# EasyEDA schematic New Project.json
TITLE: Sheet_1; REV: 1.0; Date: 2023-08-31; Sheet: 1/1; Drawn By: KovaKoodaaja666; Company: Your Company
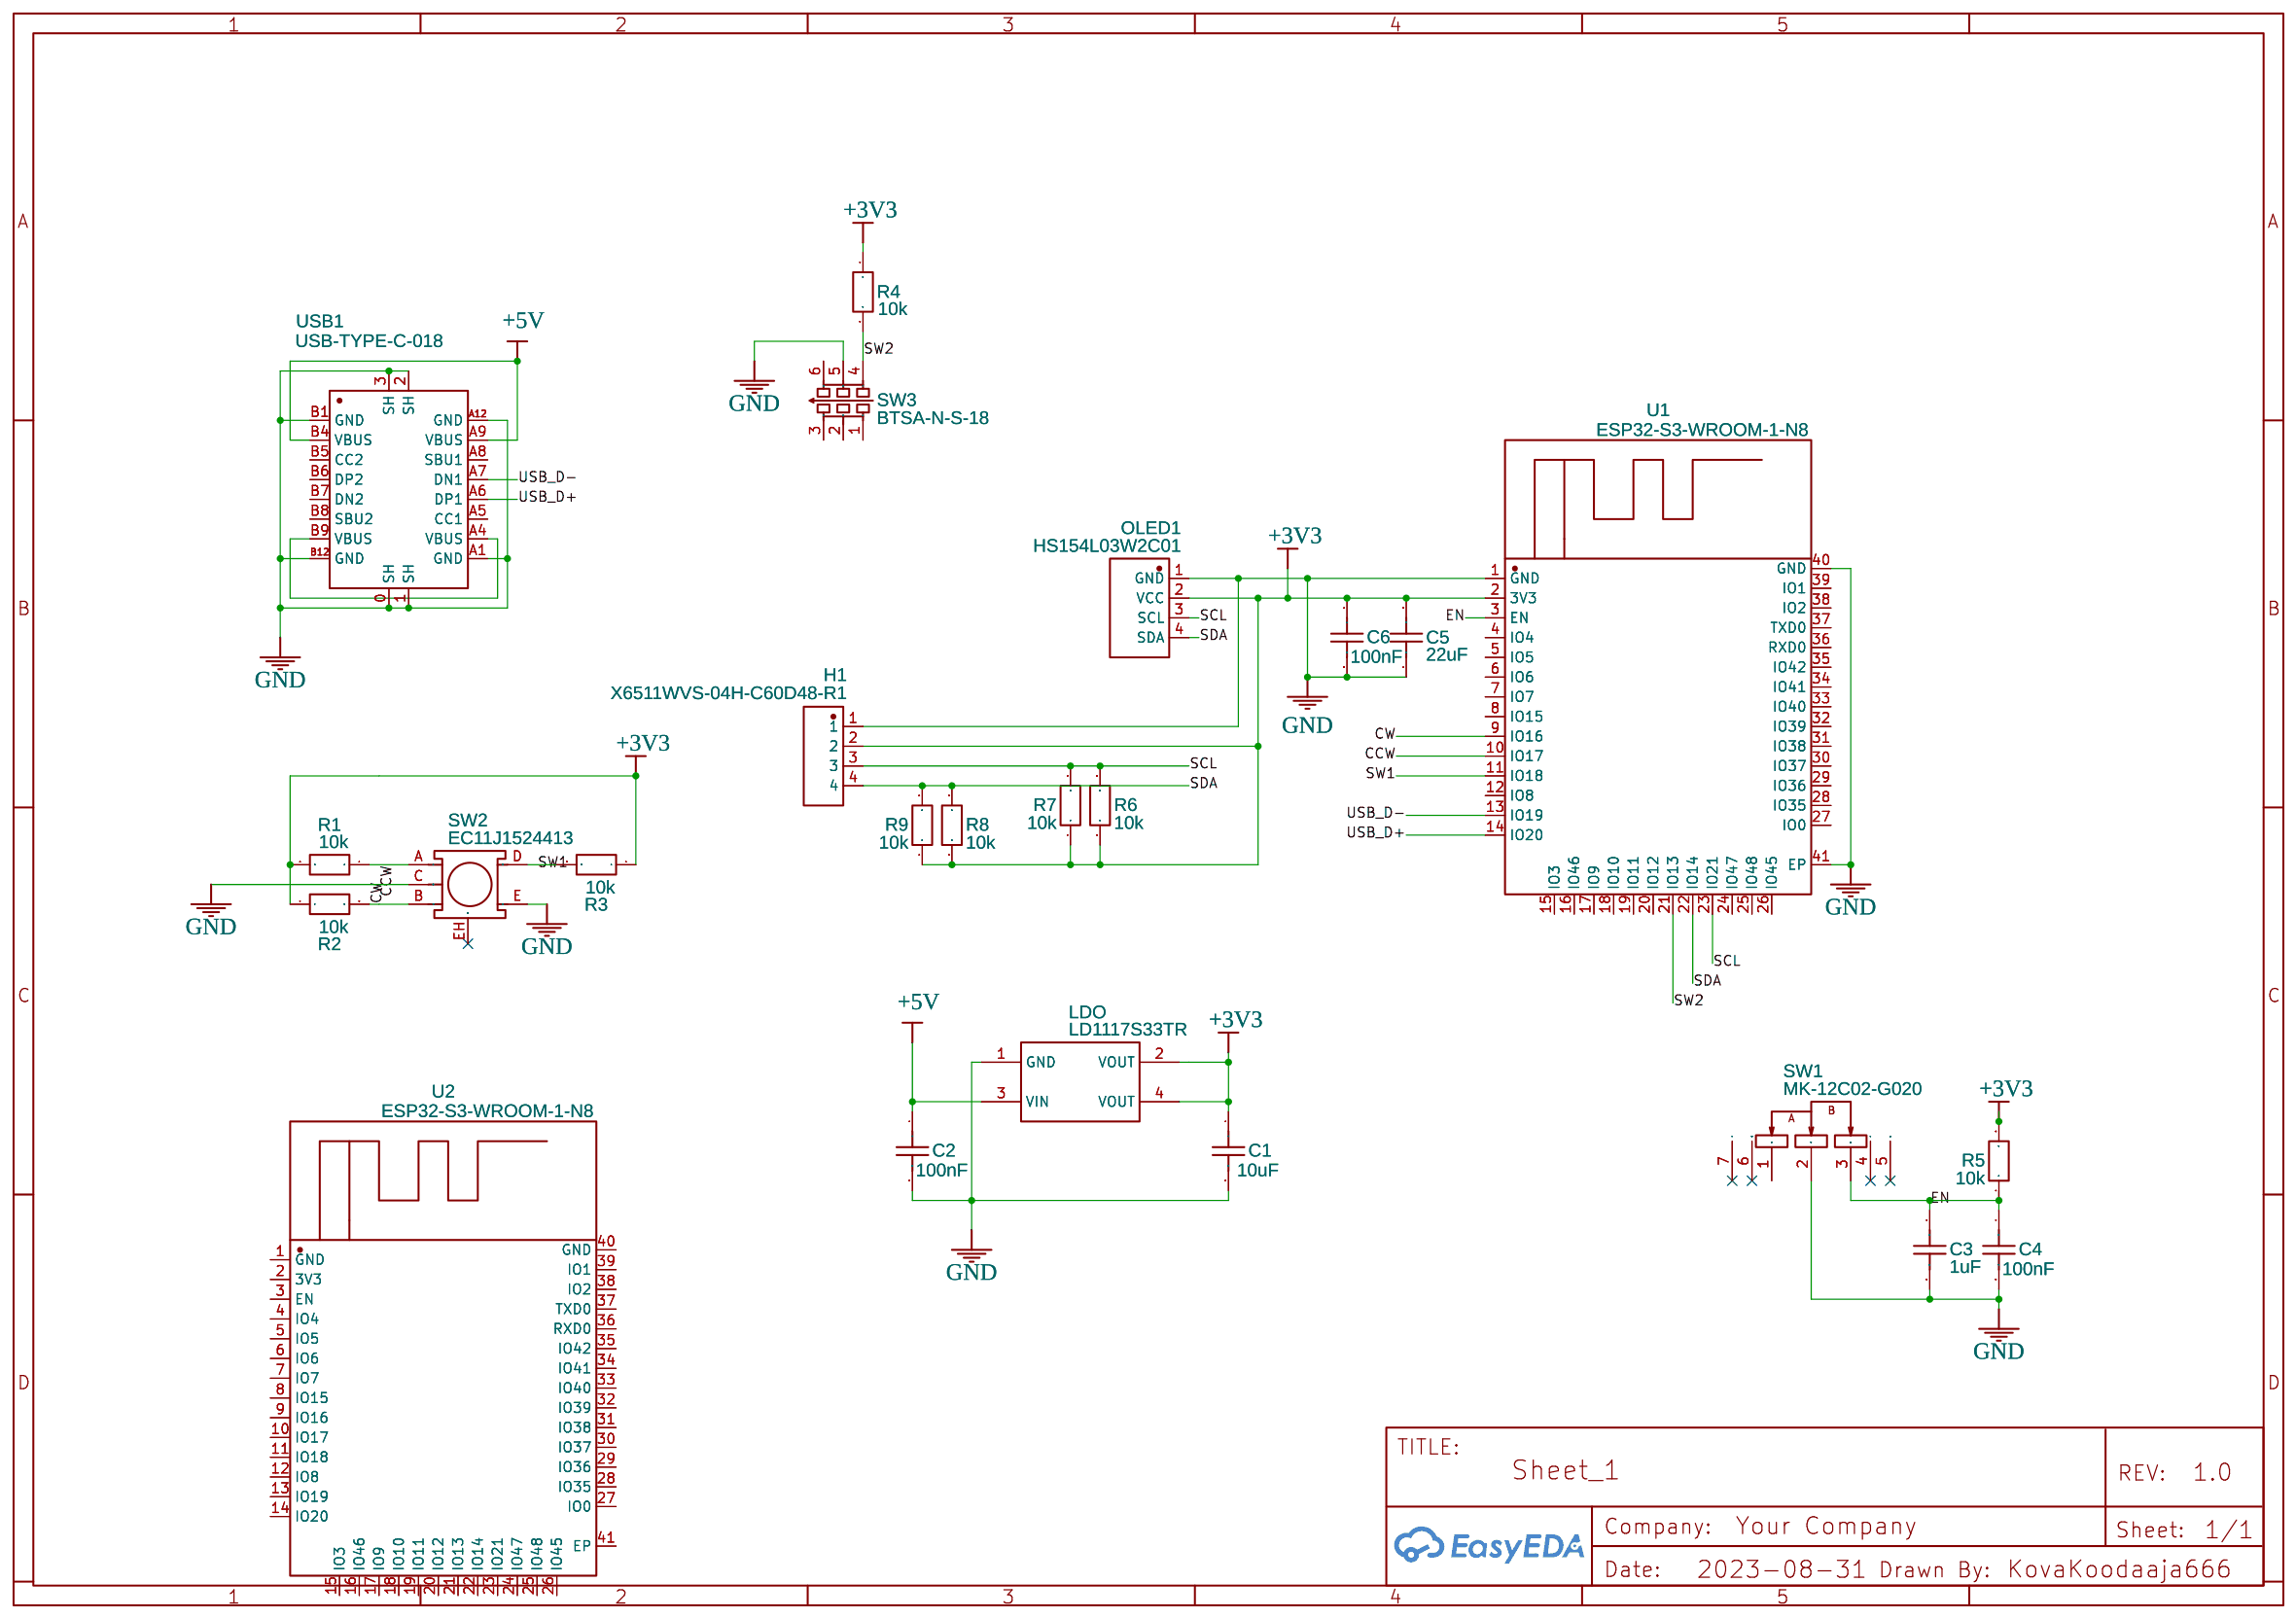
[diagram p0: schematic sheet]

## Parts
C1  10uF  [C0805]
C2  100nF  [C0805]
C3  1uF  [C0805]
C4  100nF  [C0805]
C5  22uF  [C0805]
C6  100nF  [C0805]
H1  X6511WVS-04H-C60D48-R1  [HDR-SMD_4P-P2.54-V-M-S4.8]
LDO  LD1117S33TR  [SOT-223_L6.5-W3.5-P2.30-LS7.0-BR]
OLED1  HS154L03W2C01  [OLED-TH_-4P-L42.4-W38.0-P2.54]
R1  10k  [R0603]
R2  10k  [R0603]
R3  10k  [R0603]
R4  10k  [R0603]
R5  10k  [R0603]
R6  10k  [R0603]
R7  10k  [R0603]
R8  10k  [R0603]
R9  10k  [R0603]
SW1  MK-12C02-G020  [SW-SMD_MK-12C02-G020]
SW2  EC11J1524413  [SW-SMD_EC11J1524413]
SW3  BTSA-N-S-18  [SW-SMD_BTSA-X-S-18]
U1  ESP32-S3-WROOM-1-N8  [ESP32 S3 WROOM1 N8]
U2  ESP32-S3-WROOM-1-N8  [WIFIM-SMD_ESP32-S3-WROOM-1-N8]
USB1  USB-TYPE-C-018  [USB-C_SMD-TYPE-C-31-M-12]

## Library data of the parts
C1 = TCC0805X5R106K100FT: Supplier: LCSC; Supplier Part: C380331; Manufacturer: CCTC(三环); Contributor: LCSC; JLCPCB Part Class: Extended Part
C2 C4 C6 = C0805B104K500NT: Supplier: LCSC; Supplier Part: C476766; Manufacturer: TORCH(火炬); Contributor: LCSC; JLCPCB Part Class: Extended Part
C3 = 0805B105K500NT_C215803: Contributor: LCSC; Supplier: LCSC; Supplier Part: C215803; Manufacturer: FH(风华); JLCPCB Part Class: Extended Part
C5 = TCC0805X5R226M100FT: Contributor: LCSC; Supplier: LCSC; Supplier Part: C380338; Manufacturer: CCTC(三环); JLCPCB Part Class: Extended Part; link: https://lcsc.com/eda_search?q=C380338&%26type=1&ref=editor
H1 = X6511WVS-04H-C60D48-R1: Contributor: LCSC; Supplier: LCSC; Supplier Part: C780062; Manufacturer: XKB Connectivity(中国星坤); Manufacturer Part: X6511WVS-04H-C60D48R1; JLCPCB Part Class: Extended Part; link: https://lcsc.com/eda_search?q=C780062&%26type=1&ref=editor
LDO = LD1117S33TR: Supplier: LCSC; Supplier Part: C86781; Manufacturer: ST(意法半导体); Contributor: LCSC; JLCPCB Part Class: Extended Part
OLED1 = HS154L03W2C01: Supplier: LCSC; Supplier Part: C7465998; Manufacturer: HS(汉昇); Contributor: lcsc; link: https://lcsc.com/eda_search?q=C7465999&%26type=1&ref=editor
R1-R9 = FRC0603J103TS: Contributor: LCSC; Supplier: LCSC; Supplier Part: C2930027; Manufacturer: FOJAN(富捷); JLCPCB Part Class: Extended Part; link: https://lcsc.com/eda_search?q=C2930027&%26type=1&ref=editor
SW1 = MK-12C02-G020: Contributor: LCSC; Supplier: LCSC; Supplier Part: C963206; Manufacturer: G-Switch; JLCPCB Part Class: Extended Part; link: https://lcsc.com/eda_search?q=C963206&%26type=1&ref=editor
SW2 = EC11J1524413: Contributor: LCSC; Supplier: LCSC; Supplier Part: C470592; Manufacturer: ALPSALPINE(阿尔卑斯阿尔派); JLCPCB Part Class: Extended Part; link: https://lcsc.com/eda_search?q=C470592&%26type=1&ref=editor
SW3 = BTSA-N-S-18: Contributor: LCSC; Supplier: LCSC; Supplier Part: C2693642; Manufacturer: ROCPU Switches(台普); JLCPCB Part Class: Extended Part; link: https://lcsc.com/eda_search?q=C2693642&%26type=1&ref=editor
U1 U2 = ESP32-S3-WROOM-1-N8: Contributor: lcsc; Supplier: LCSC; Supplier Part: C2913198; Manufacturer: ESPRESSIF(乐鑫); JLCPCB Part Class: Extended Part; link: https://lcsc.com/eda_search?q=C2913198&%26type=1&ref=editor
USB1 = USB-TYPE-C-018: Contributor: LCSC; Supplier: LCSC; Supplier Part: C2927038; Manufacturer: DEALON(德艺隆); JLCPCB Part Class: Extended Part; link: https://lcsc.com/eda_search?q=C2927038&%26type=1&ref=editor

## Nets
+3V3: C1.1 C5.2 C6.1 H1.2 LDO.2(VOUT) LDO.4(VOUT) OLED1.2(VCC) R1.2 R2.1 R3.1 R4.1 R5.2 R6.1 R7.1 R8.1 R9.1 U1.2(3V3)
+5V: C2.1 LDO.3(VIN) USB1.A9(VBUS) USB1.B4(VBUS)
GND: C1.2 C2.2 C3.2 C4.2 C5.1 C6.2 H1.1 LDO.1(GND) OLED1.1(GND) SW1.2 SW2.C SW2.E SW3.5 U1.1(GND) U1.40(GND) U1.41(EP) USB1.0(SH) USB1.1(SH) USB1.2(SH) USB1.3(SH) USB1.A1(GND) USB1.A12(GND) USB1.B1(GND) USB1.B12(GND)
CCW: R1.1 SW2.A U1.10(IO17)
CW: R2.2 SW2.B U1.9(IO16)
EN: C3.1 C4.1 R5.1 SW1.3 U1.3(EN)
SCL: H1.3 OLED1.3(SCL) R6.2 R7.2 U1.23(IO21)
SDA: H1.4 OLED1.4(SDA) R8.2 R9.2 U1.22(IO14)
SW1: R3.2 SW2.D U1.11(IO18)
SW2: R4.2 SW3.4 U1.21(IO13)
USB_D+: U1.14(IO20) USB1.A6(DP1)
USB_D-: U1.13(IO19) USB1.A7(DN1)
Net-(USB1-A4): USB1.A4(VBUS) USB1.B9(VBUS)

Not connected (* = marked no-connect by the designer): SW1 1 4* 5* 6* 7*; SW2 EH*; SW3 1 2 3 6; U1 4(IO4) 5(IO5) 6(IO6) 7(IO7) 8(IO15) 12(IO8) 15(IO3) 16(IO46) 17(IO9) 18(IO10) 19(IO11) 20(IO12) 24(IO47) 25(IO48) 26(IO45) 27(IO0) 28(IO35) 29(IO36) 30(IO37) 31(IO38) 32(IO39) 33(IO40) 34(IO41) 35(IO42) 36(RXD0) 37(TXD0) 38(IO2) 39(IO1); U2 1(GND) 2(3V3) 3(EN) 4(IO4) 5(IO5) 6(IO6) 7(IO7) 8(IO15) 9(IO16) 10(IO17) 11(IO18) 12(IO8) 13(IO19) 14(IO20) 15(IO3) 16(IO46) 17(IO9) 18(IO10) 19(IO11) 20(IO12) 21(IO13) 22(IO14) 23(IO21) 24(IO47) 25(IO48) 26(IO45) 27(IO0) 28(IO35) 29(IO36) 30(IO37) 31(IO38) 32(IO39) 33(IO40) 34(IO41) 35(IO42) 36(RXD0) 37(TXD0) 38(IO2) 39(IO1) 40(GND) 41(EP); USB1 A5(CC1) A8(SBU1) B5(CC2) B6(DP2) B7(DN2) B8(SBU2)
